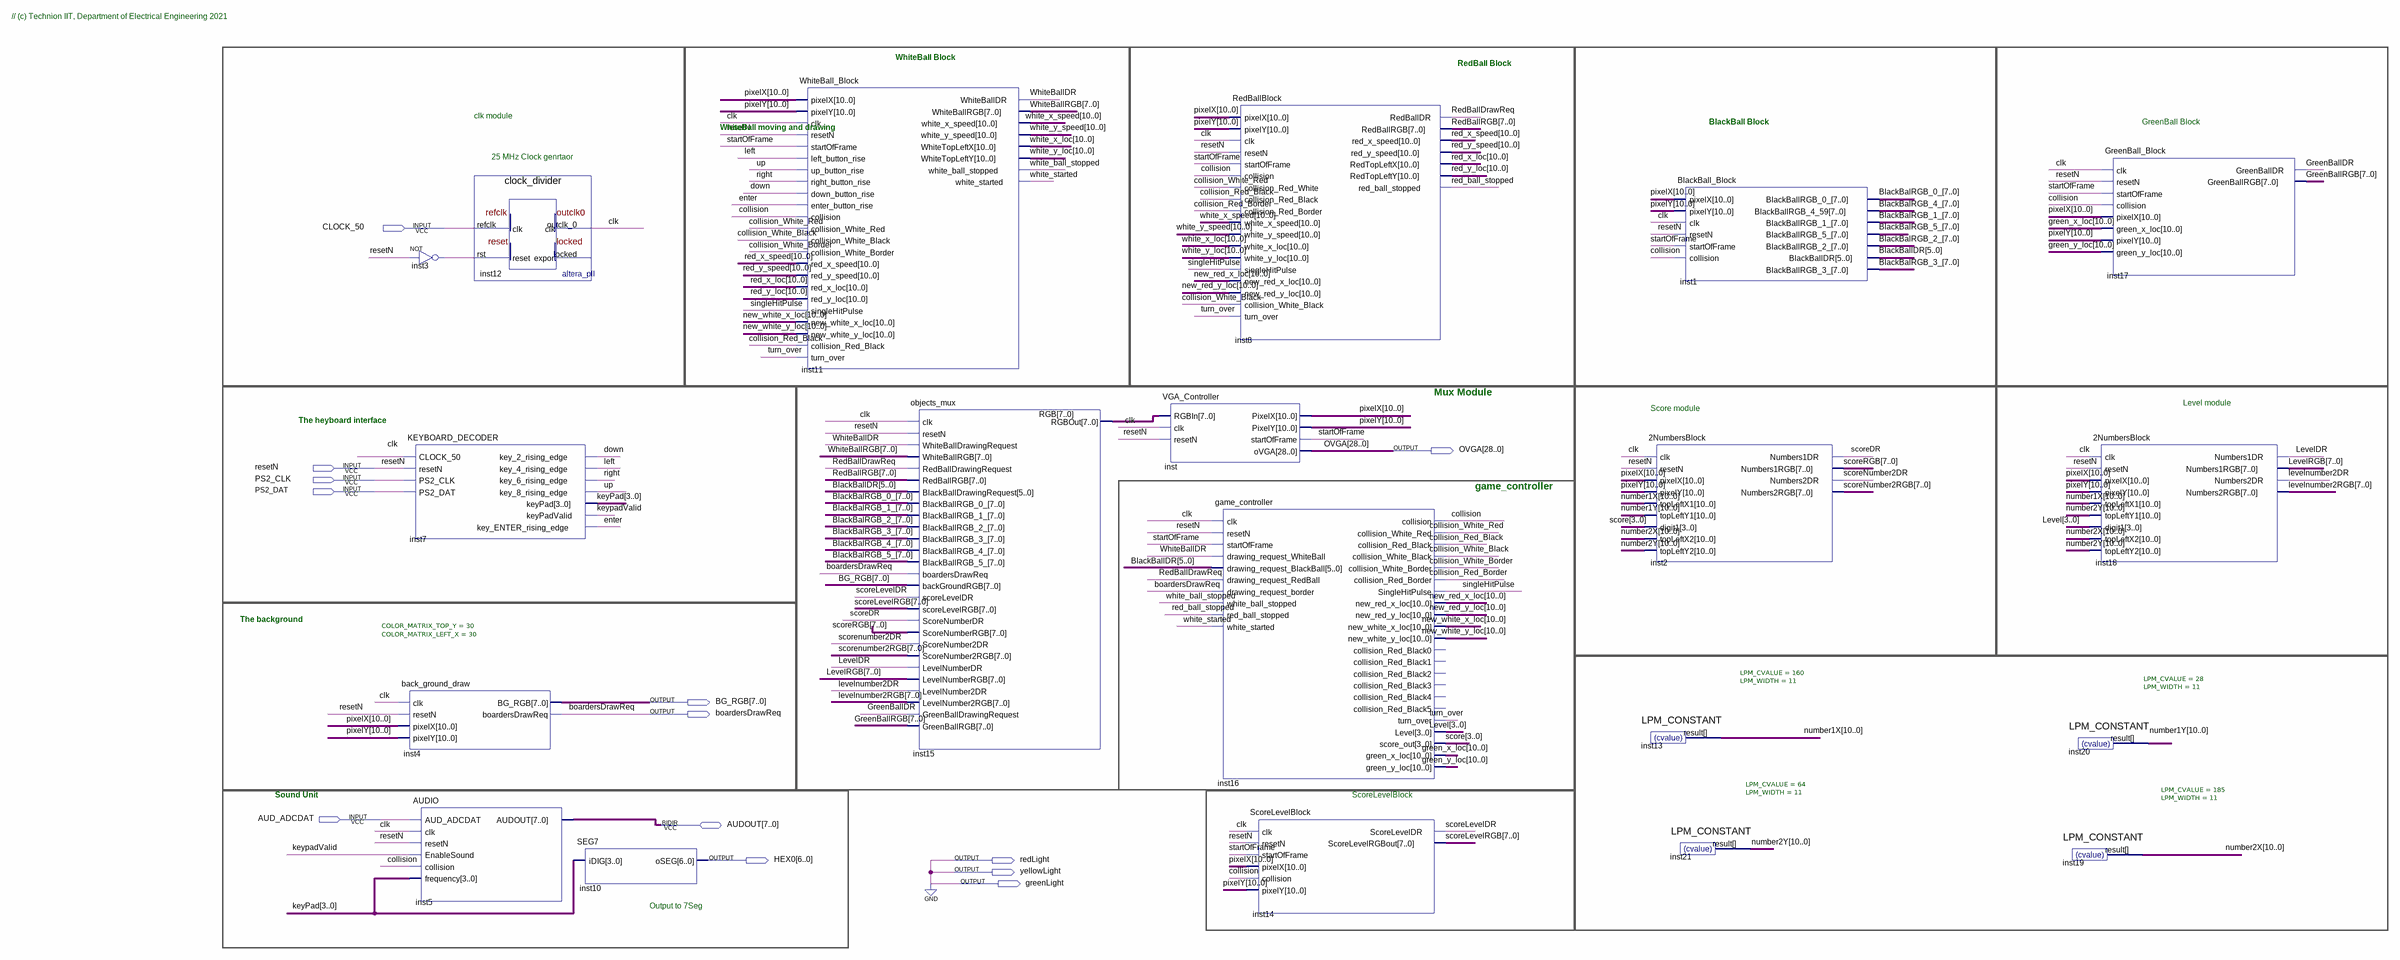
[diagram p0: schematic sheet]
// Quartus schematic TOP_VGA_DEMO_KBD.bdf as structural Verilog: 20 symbols, 13 pins
module TOP_VGA_DEMO_KBD (
  input  CLOCK_50,
  input  resetN,
  input  PS2_CLK,
  input  PS2_DAT,
  input  AUD_ADCDAT,
  inout  [7:0] AUDOUT,
  output [28:0] OVGA,
  output [7:0] BG_RGB,
  output boardersDrawReq,
  output [6:0] HEX0,
  output redLight,
  output yellowLight,
  output greenLight
);

  wire clk, collision, collision_Red_Black, collision_Red_Border, collision_White_Black,
       collision_White_Border, collision_White_Red, down, enter, GreenBallDR, inst3_out, keypadValid, left,
       LevelDR, levelnumber2DR, red_ball_stopped, RedBallDrawReq, right, scoreDR, scoreLevelDR,
       scoreNumber2DR, singleHitPulse, startOfFrame, turn_over, up, white_ball_stopped, white_started,
       WhiteBallDR;
  wire [3:0] keyPad, Level, score;
  wire [5:0] BlackBallDR;
  wire [7:0] BlackBalRGB_0_, BlackBalRGB_1_, BlackBalRGB_2_, BlackBalRGB_3_, BlackBalRGB_4_, BlackBalRGB_5_,
       GreenBallRGB, levelnumber2RGB, LevelRGB, RedBallRGB, RGB, scoreLevelRGB, scoreNumber2RGB, scoreRGB,
       WhiteBallRGB;
  wire [10:0] green_x_loc, green_y_loc, new_red_x_loc, new_red_y_loc, new_white_x_loc, new_white_y_loc,
       number1X, number1Y, number2X, number2Y, pixelX, pixelY, red_x_loc, red_x_speed, red_y_loc,
       red_y_speed, white_x_loc, white_x_speed, white_y_loc, white_y_speed;

  not inst3 (inst3_out, resetN);
  KEYBOARD_DECODER inst7 (
    .CLOCK_50(clk), .resetN(resetN), .PS2_CLK(PS2_CLK), .PS2_DAT(PS2_DAT), .key_2_rising_edge(down),
    .key_4_rising_edge(left), .key_6_rising_edge(right), .key_8_rising_edge(up), .keyPad(keyPad),
    .keyPadValid(keypadValid), .key_ENTER_rising_edge(enter));
  back_ground_draw #(.COLOR_MATRIX_TOP_Y(30), .COLOR_MATRIX_LEFT_X(30)) inst4 (
    .clk(clk), .resetN(resetN), .pixelX(pixelX), .pixelY(pixelY), .BG_RGB(BG_RGB),
    .boardersDrawReq(boardersDrawReq));
  AUDIO inst5 (
    .AUD_ADCDAT(AUD_ADCDAT), .clk(clk), .resetN(resetN), .EnableSound(keypadValid), .collision(collision),
    .frequency(keyPad), .AUDOUT(AUDOUT));
  clock_divider inst12 (.refclk(CLOCK_50), .rst(inst3_out), .outclk_0(clk));  // open: locked
  SEG7 inst10 (.iDIG(keyPad), .oSEG(HEX0));
  WhiteBall_Block inst11 (
    .pixelX(pixelX), .pixelY(pixelY), .clk(clk), .resetN(resetN), .startOfFrame(startOfFrame),
    .left_button_rise(left), .up_button_rise(up), .right_button_rise(right), .down_button_rise(down),
    .enter_button_rise(enter), .collision(collision), .collision_White_Red(collision_White_Red),
    .collision_White_Black(collision_White_Black), .collision_White_Border(collision_White_Border),
    .red_x_speed(red_x_speed), .red_y_speed(red_y_speed), .red_x_loc(red_x_loc), .red_y_loc(red_y_loc),
    .singleHitPulse(singleHitPulse), .new_white_x_loc(new_white_x_loc), .new_white_y_loc(new_white_y_loc),
    .collision_Red_Black(collision_Red_Black), .turn_over(turn_over), .WhiteBallDR(WhiteBallDR),
    .WhiteBallRGB(WhiteBallRGB), .white_x_speed(white_x_speed), .white_y_speed(white_y_speed),
    .WhiteTopLeftX(white_x_loc), .WhiteTopLeftY(white_y_loc), .white_ball_stopped(white_ball_stopped),
    .white_started(white_started));
  objects_mux inst15 (
    .clk(clk), .resetN(resetN), .WhiteBallDrawingRequest(WhiteBallDR), .WhiteBallRGB(WhiteBallRGB),
    .RedBallDrawingRequest(RedBallDrawReq), .RedBallRGB(RedBallRGB), .BlackBallDrawingRequest(BlackBallDR),
    .BlackBallRGB_0_(BlackBalRGB_0_), .BlackBallRGB_1_(BlackBalRGB_1_), .BlackBallRGB_2_(BlackBalRGB_2_),
    .BlackBallRGB_3_(BlackBalRGB_3_), .BlackBallRGB_4_(BlackBalRGB_4_), .BlackBallRGB_5_(BlackBalRGB_5_),
    .boardersDrawReq(boardersDrawReq), .backGroundRGB(BG_RGB), .scoreLevelDR(scoreLevelDR),
    .scoreLevelRGB(scoreLevelRGB), .ScoreNumberDR(scoreDR), .ScoreNumberRGB(scoreRGB),
    .ScoreNumber2DR(scoreNumber2DR), .ScoreNumber2RGB(scoreNumber2RGB), .LevelNumberDR(LevelDR),
    .LevelNumberRGB(LevelRGB), .LevelNumber2DR(levelnumber2DR), .LevelNumber2RGB(levelnumber2RGB),
    .GreenBallDrawingRequest(GreenBallDR), .GreenBallRGB(GreenBallRGB), .RGBOut(RGB));
  VGA_Controller inst (
    .RGBIn(RGB), .clk(clk), .resetN(resetN), .PixelX(pixelX), .PixelY(pixelY), .startOfFrame(startOfFrame),
    .oVGA(OVGA));
  game_controller inst16 (
    .clk(clk), .resetN(resetN), .startOfFrame(startOfFrame), .drawing_request_WhiteBall(WhiteBallDR),
    .drawing_request_BlackBall(BlackBallDR), .drawing_request_RedBall(RedBallDrawReq),
    .drawing_request_border(boardersDrawReq), .white_ball_stopped(white_ball_stopped),
    .red_ball_stopped(red_ball_stopped), .white_started(white_started), .collision(collision),
    .collision_White_Red(collision_White_Red), .collision_Red_Black(collision_Red_Black),
    .collision_White_Black(collision_White_Black), .collision_White_Border(collision_White_Border),
    .collision_Red_Border(collision_Red_Border), .SingleHitPulse(singleHitPulse),
    .new_red_x_loc(new_red_x_loc), .new_red_y_loc(new_red_y_loc), .new_white_x_loc(new_white_x_loc),
    .new_white_y_loc(new_white_y_loc), .turn_over(turn_over), .Level(Level), .score_out(score),
    .green_x_loc(green_x_loc), .green_y_loc(green_y_loc));  // open: collision_Red_Black0, collision_Red_Black1, collision_Red_Black2, collision_Red_Black3, collision_Red_Black4, collision_Red_Black5
  RedBallBlock inst8 (
    .pixelX(pixelX), .pixelY(pixelY), .clk(clk), .resetN(resetN), .startOfFrame(startOfFrame),
    .collision(collision), .collision_Red_White(collision_White_Red),
    .collision_Red_Black(collision_Red_Black), .collision_Red_Border(collision_Red_Border),
    .white_x_speed(white_x_speed), .white_y_speed(white_y_speed), .white_x_loc(white_x_loc),
    .white_y_loc(white_y_loc), .singleHitPulse(singleHitPulse), .new_red_x_loc(new_red_x_loc),
    .new_red_y_loc(new_red_y_loc), .collision_White_Black(collision_White_Black), .turn_over(turn_over),
    .RedBallDR(RedBallDrawReq), .RedBallRGB(RedBallRGB), .red_x_speed(red_x_speed),
    .red_y_speed(red_y_speed), .RedTopLeftX(red_x_loc), .RedTopLeftY(red_y_loc),
    .red_ball_stopped(red_ball_stopped));
  ScoreLevelBlock inst14 (
    .clk(clk), .resetN(resetN), .startOfFrame(startOfFrame), .pixelX(pixelX), .collision(collision),
    .pixelY(pixelY), .ScoreLevelDR(scoreLevelDR), .ScoreLevelRGBout(scoreLevelRGB));
  BlackBall_Block inst1 (
    .pixelX(pixelX), .pixelY(pixelY), .clk(clk), .resetN(resetN), .startOfFrame(startOfFrame),
    .collision(collision), .BlackBallRGB_0_(BlackBalRGB_0_), .BlackBallRGB_4_59(BlackBalRGB_4_),
    .BlackBallRGB_1_(BlackBalRGB_1_), .BlackBallRGB_5_(BlackBalRGB_5_), .BlackBallRGB_2_(BlackBalRGB_2_),
    .BlackBallDR(BlackBallDR), .BlackBallRGB_3_(BlackBalRGB_3_));
  \2NumbersBlock  inst2 (
    .clk(clk), .resetN(resetN), .pixelX(pixelX), .pixelY(pixelY), .topLeftX1(number1X), .topLeftY1(number1Y),
    .digit1(score), .topLeftX2(number2X), .topLeftY2(number2Y), .Numbers1DR(scoreDR), .Numbers1RGB(scoreRGB),
    .Numbers2DR(scoreNumber2DR), .Numbers2RGB(scoreNumber2RGB));
  LPM_CONSTANT #(.LPM_CVALUE(160), .LPM_WIDTH(11)) inst13 (.result(number1X));
  LPM_CONSTANT #(.LPM_CVALUE(64), .LPM_WIDTH(11)) inst21 (.result(number2Y));
  GreenBall_Block inst17 (
    .clk(clk), .resetN(resetN), .startOfFrame(startOfFrame), .collision(collision), .pixelX(pixelX),
    .green_x_loc(green_x_loc), .pixelY(pixelY), .green_y_loc(green_y_loc), .GreenBallDR(GreenBallDR),
    .GreenBallRGB(GreenBallRGB));
  \2NumbersBlock  inst18 (
    .clk(clk), .resetN(resetN), .pixelX(pixelX), .pixelY(pixelY), .topLeftX1(number1X), .topLeftY1(number2Y),
    .digit1(Level), .topLeftX2(number2X), .topLeftY2(number2Y), .Numbers1DR(LevelDR), .Numbers1RGB(LevelRGB),
    .Numbers2DR(levelnumber2DR), .Numbers2RGB(levelnumber2RGB));
  LPM_CONSTANT #(.LPM_CVALUE(28), .LPM_WIDTH(11)) inst20 (.result(number1Y));
  LPM_CONSTANT #(.LPM_CVALUE(185), .LPM_WIDTH(11)) inst19 (.result(number2X));

  assign greenLight = 1'b0;
  assign redLight = 1'b0;
  assign yellowLight = 1'b0;

  // Notes on the sheet:
  //   // (c) Technion IIT, Department of Electrical Engineering 2021
  //   WhiteBall Block
  //   RedBall Block
  //   clk module
  //   BlackBall Block
  //   GreenBall Block
  //   WhiteBall moving and drawing
  //   25 MHz Clock genrtaor
  //   Mux Module
  //   Level module
  //   Score module
  //   The heyboard interface
  //   game_controller
  //   The background
  //   Sound Unit
  //   ScoreLevelBlock
  //   Output to 7Seg
endmodule
